# EAGLE design pic_pico (EAGLE 7.5.0)
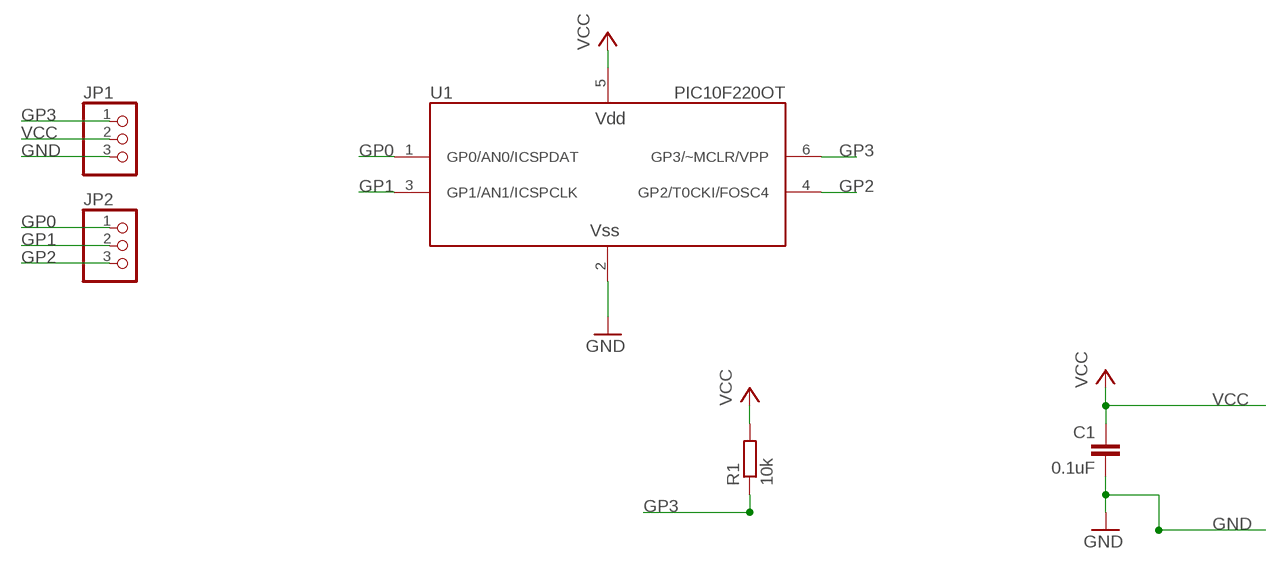
[diagram p0: schematic, sheet 1]

## Parts
C1  0.1uF  C-EUC0603  [C0603]
JP1  PINHD-1X3  [1X03]
JP2  PINHD-1X3  [1X03]
R1  10k  R-EU_R0603  [R0603]
U1  PIC10F220OT  [SOT-23-6]

## Nets
GND [GND]: C1.2 JP1.3 U1.2(VSS)
GP0: JP2.1 U1.1(GP0/AN0/ICSPDAT)
GP1: JP2.2 U1.3(GP1/AN1/ICSPCLK)
GP2: JP2.3 U1.4(GP2/T0CKI/FOSC4)
GP3: JP1.1 R1.1 U1.6(GP3/~MCLR/VPP)
VCC [VCC]: C1.1 JP1.2 R1.2 U1.5(VDD)

## Library data of the parts
C1 = resistor:C-EU: CAPACITOR, European symbol
JP1 JP2 = pinhead:PINHD-1X3: PIN HEADER
R1 = resistor:R-EU_: RESISTOR, European symbol
U1 = microchip2:PIC10F22*: Microchip PIC10F220 and 222 6-pin 8-bit Flash microcontroller 256/512 words program memory, 16/23 bytes RAM 4 I/O, 1 8-bit timer, 1 8-bit A/D on PIC10F222

## Net classes
0 default: width 0.254 mm, drill 0.508 mm
1 GND: width 0.406 mm, drill 0.508 mm
2 VCC: width 0.406 mm, drill 0.508 mm

## Board
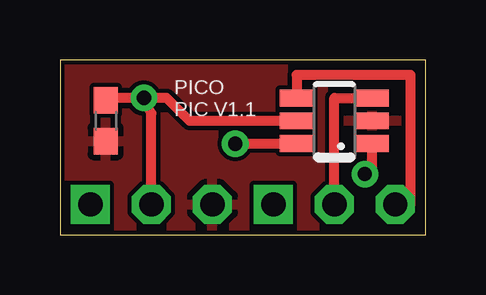
[diagram p1: board, top side]
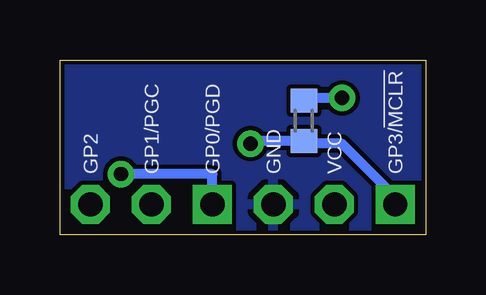
[diagram p2: board, bottom side, seen from below]

Size 15.24 x 7.3 mm. Coordinates in mm from the lower left corner, seen from the top.
Outline: 0,0 15.24,0 15.24,7.3 0,7.3 0,0
Copper layers (1*16): Top 0.035mm / dielectric 1.5mm / Bottom 0.035mm
Design rules "SparkFun *": minimum track width 10mil, minimum drill 20mil, track to track 7mil, track to pad 7mil, pad to pad 8mil, via to via 8mil, smd to smd 8mil, copper to edge 7mil, drill to drill 7mil, minimum pad ring 12mil, minimum via ring 10mil, stop-mask expansion 4mil, vias tented up to drill 25mil, thermal gap 10mil

### Footprints (pad centres in the part's own frame; a part is rotated, then mirrored left to right if it is on the bottom)
C0603 = smd 1.1 x 1: 1 -0.85,0; 2 0.85,0
1X03 = drill 1.016 square: 1 -2.54,0 | drill 1.016 octagon: 2 0,0; 3 2.54,0
R0603 = smd 1 x 1.1: 1 -0.85,0; 2 0.85,0
SOT-23-6 = smd 0.7 x 1.4: 1 -0.953,-1.57; 2 0,-1.57; 3 0.953,-1.57; 4 0.953,1.57; 5 -0.003,1.57; 6 -0.95,1.57

### Placement (x,y rotation side)
C1  1.91,4.76 270 top
JP1  3.81,1.27 0 top
JP2  11.43,1.27 0 top
R1  5.08,4.76 90 bottom
U1  11.43,4.76 90 top

### Tracks (layer width: path | path; a pad name or v marks a point on that pad's centre or on a via)
GND
  pour Top: -0.32,7.3 15.56,7.3 15.56,-0.32 -0.32,-0.32
  pour Bottom: -0.32,7.3 15.56,7.3 15.56,-0.32 -0.32,-0.32
GP0  (via drill 0.6)
  Top 0.406: v12.7,2.54 13,2.54 U1.1
  Bottom 0.406: JP2.1 8.89,2.54 v12.7,2.54
GP1
  Top 0.406: JP2.2 11.43,5.71 U1.3
GP2
  Top 0.406: JP2.3 14.61,1.27 14.61,6.67 9.86,6.67 U1.4
GP3  (via drill 0.6)
  Top 0.406: v7.3,3.81 U1.6
  Bottom 0.406: v7.3,3.81 7.2,3.91 R1.1 4.98,3.81 3.49,3.81 1.27,1.59 JP1.1
VCC  (via drill 0.6)
  Top 0.406: JP1.2 3.81,5.08 v3.49,5.71 | v3.49,5.71 1.69,5.71 C1.1 | U1.5 5.4,4.76 4.44,5.71 v3.49,5.71
  Bottom 0.406: v3.49,5.71 4.98,5.71 R1.2

### Text on the board
tNames: PICO / PIC V1.1
bNames: GP3/!MCLR | VCC | GND | GP0/PGD | GP1/PGC | GP2